# Altium schematic sheet SensorPower.SchDoc
size A; SheetNumber: 9; SheetTotal: 11
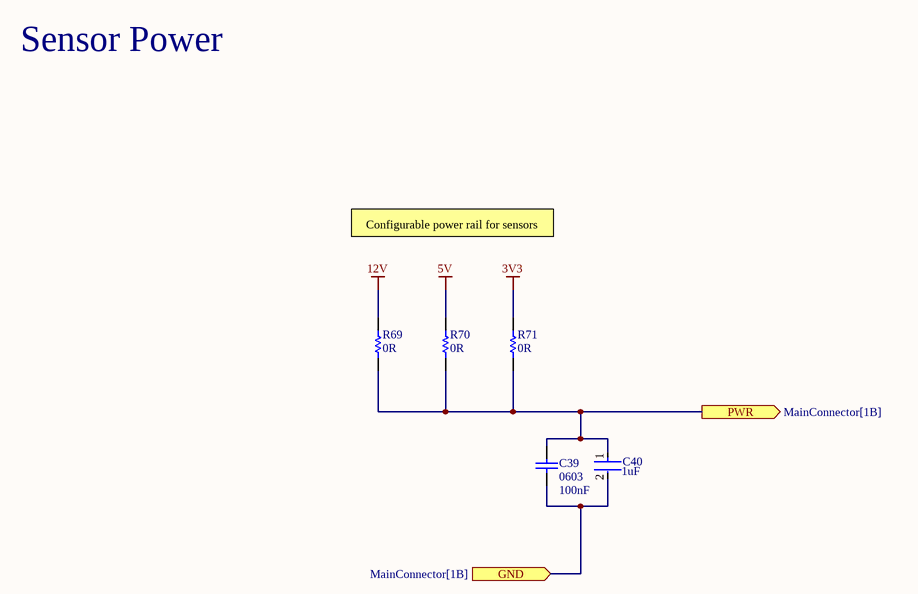
[diagram p0: SensorPower.SchDoc]

## Parts
C39  Case Code (Imperial): 0603  Capacitance: 100nF  [CAPC1608X87X35NL15T15]  (hidden comment: C0603X104K5RACTU)
C40  Capacitance: 1uF  [FP-CL10-IPC_C]  (hidden comment: CL10A105KA8NNNC)
R69  Resistance: 0R  [RESC2013X60X35LL10T20]  (hidden comment: RC0805JR-100RL)
R70  Resistance: 0R  [RESC2013X60X35LL10T20]  (hidden comment: RC0805JR-100RL)
R71  Resistance: 0R  [RESC2013X60X35LL10T20]  (hidden comment: RC0805JR-100RL)

## Ports
GND (in, see MainConnector[1B]), PWR (out, see MainConnector[1B])

## Nets
3V3: R71.1
5V: R70.1
12V: R69.1
GND: C39.2 C40.2 ; port GND
PWR: C39.1 C40.1 R69.2 R70.2 R71.2 ; port PWR

## Notes on the sheet
- Sensor Power
- Configurable power rail for sensors

## Library data of the parts
C39 = CMP-2006-03300-1: Manufacturer: Kemet; Dielectric Material: Ceramic; Tolerance: 10%; Voltage Rating: 50V; Dielectric: X7R; Dissipation Factor: 2.5%; Part Number: C0603X104K5RACTU; Supplier 1: Digi-Key; Supplier Part Number 1: 399-7969-1-ND; Manufacturer Part Number: C0603X104K5RACTU; Stock 1: 2206541; Pricing 1: 1 = 0.21000, 10 = 0.14500, 100 = 0.07340, 500 = 0.05024, 1000 = 0.04444 (USD); RoHS: Yes; Mount: Surface Mount; Case/Package: 0603; Number of Pins: 2; Case Code (Metric): 1608; Min Operating Temperature: -55°C; Max Operating Temperature: 125°C; Packaging: Tape and Reel; Package Quantity: 1; Voltage Rating (DC): 50V; Termination: SMD/SMT; Voltage: 50V; Features: Soft Termination; Length: 1.6mm; Height: 0.8mm; Width: 0.8mm; Depth: 0.8mm; Thickness: 0.034inch; Radiation Hardening: No; REACH SVHC: No SVHC; ComponentLink1URL: https://datasheet.ciiva.com/7823/1776088-7823908.pdf?src-supplier=Element14; ComponentLink1Description: https://datasheet.ciiva.com/7823/1776088-7823908.pdf?src-supplier=Element14; ComponentLink2URL: https://datasheet.ciiva.com/26948/getdatasheetpartid-385607-26948458.pdf?src-supplier=Verical; ComponentLink2Description: https://datasheet.ciiva.com/26948/getdatasheetpartid-385607-26948458.pdf?src-supplier=Verical; ComponentLink3URL: https://datasheet.ciiva.com/7823/1776088-7823909.pdf?src-supplier=Element14; ComponentLink3Description: https://datasheet.ciiva.com/7823/1776088-7823909.pdf?src-supplier=Element14; ComponentLink4URL: https://datasheet.ciiva.com/6279/kem-c1013-x7r-ft-cap-smd-6279993.pdf?src-supplier=Digi-Key; ComponentLink4Description: https://datasheet.ciiva.com/6279/kem-c1013-x7r-ft-cap-smd-6279993.pdf?src-supplier=Digi-Key; ComponentLink5URL: https://datasheet.ciiva.com/28533/1918693-28533212.pdf?src-supplier=Element14; ComponentLink5Description: https://datasheet.ciiva.com/28533/1918693-28533212.pdf?src-supplier=Element14; ComponentLink6URL: https://datasheet.ciiva.com/6279/kem-c1013-x7r-ft-cap-smd-6279999.pdf?src-supplier=Digi-Key; ComponentLink6Description: https://datasheet.ciiva.com/6279/kem-c1013-x7r-ft-cap-smd-6279999.pdf?src-supplier=Digi-Key; ComponentLink7URL: https://datasheet.ciiva.com/6279/kem-c1013-x7r-ft-cap-smd-6279990.pdf?src-supplier=Digi-Key; ComponentLink7Description: https://datasheet.ciiva.com/6279/kem-c1013-x7r-ft-cap-smd-6279990.pdf?src-supplier=Digi-Key; ComponentLink8URL: https://datasheet.ciiva.com/14597/70096394-14597743.pdf?src-supplier=Allied+Electronics; ComponentLink8Description: https://datasheet.ciiva.com/14597/70096394-14597743.pdf?src-supplier=Allied+Electronics
C40 = CMP-13271-004127-1: Cap Ceramic 1uF 25V X5R ±10% Pad SMD 0603 +85°C T/R; Height: 0.8mm; Depth: 0.8mm; Package Quantity: 1; Mount: Surface Mount; Contact Plating: Tin; Voltage Rating: 25V; Dielectric: X5R; Packaging: Tape and Reel; Material: Ceramic; Case Code (Metric): 1608; Length: 1.6mm; Voltage: 25V; Min Operating Temperature: -55°C; Width: 0.031inch; Tolerance: 10%; Case/Package: 0603; Radiation Hardening: No; Case Code (Imperial): 0603; Thickness: 0.035inch; Lead Free: Lead Free; Max Operating Temperature: 85°C; Voltage Rating (DC): 25V
R69-R71 = CMP-2000-06963-1: Chip Resistor, 0 Ohm, +/- 5%, 125 mW, -55 to 155 degC, 0805 (2012 Metric), RoHS, Tape and Reel; Manufacturer: Yageo; Product Length (mm): 2mm; Tolerance (+ or -): NotRequired; Case Style: Molded; Product Height (mm): 0.5mm; Power Rating(s): NotRequiredW; Product Depth (mm): 1.25mm; Mounting Technology: SurfaceMount; Military Standard: NotRequired; Operating Temp Range: -55Cto155C; Temperature Coefficient: NotRequired; Package Description: 2-Pin Surface Mounted Device, Body 2 x 1.25 mm; Datasheet Version: Rev. 7, 05/2017; Failure Rate: NotRequired; Manufacturer URL: http://www.yageo.com/; Datasheet URL: http://www.yageo.com/documents/recent/PYu-RC_Group_51_RoHS_L_7.pdf; Packaging: TapeandReel; Package Reference: 0805; Package / Case: 0805; Termination Style: NotRequired; Type: ThickFilm; Construction: Rectangular; DNP: DNP